# Altium schematic sheet Probe-Scope AFE v1.0.SchDoc: Probe-Scope: Analog Frontend
size Tabloid; CompanyName: Probe-Scope; Organization: Probe-Scope; Address1: Probe-Scope: Unified USB; Address2: Oscilloscope Probe; Address3: ©2019 M. Omo, J. Rowley,; SheetNumber: 3; PageSetup: Record=PageOptions|CenterHorizontal=True|CenterVertical=True|PrintScale=0.96|XCorrection=1.00|YCorrection=1.00|PrintKind=1|BorderSize=5000000|LeftOffset=0|BottomOffset=0|Orientation=2|PaperLength=1000|PaperWidth=1000|Scale=100|PaperSource=7|PrintQuality=-4|MediaType=1|DitherType=10|PaperKind=11x17|PrintScaleMode=1; Address4: K. Hall, released under the; License: CERN OHL v1.2
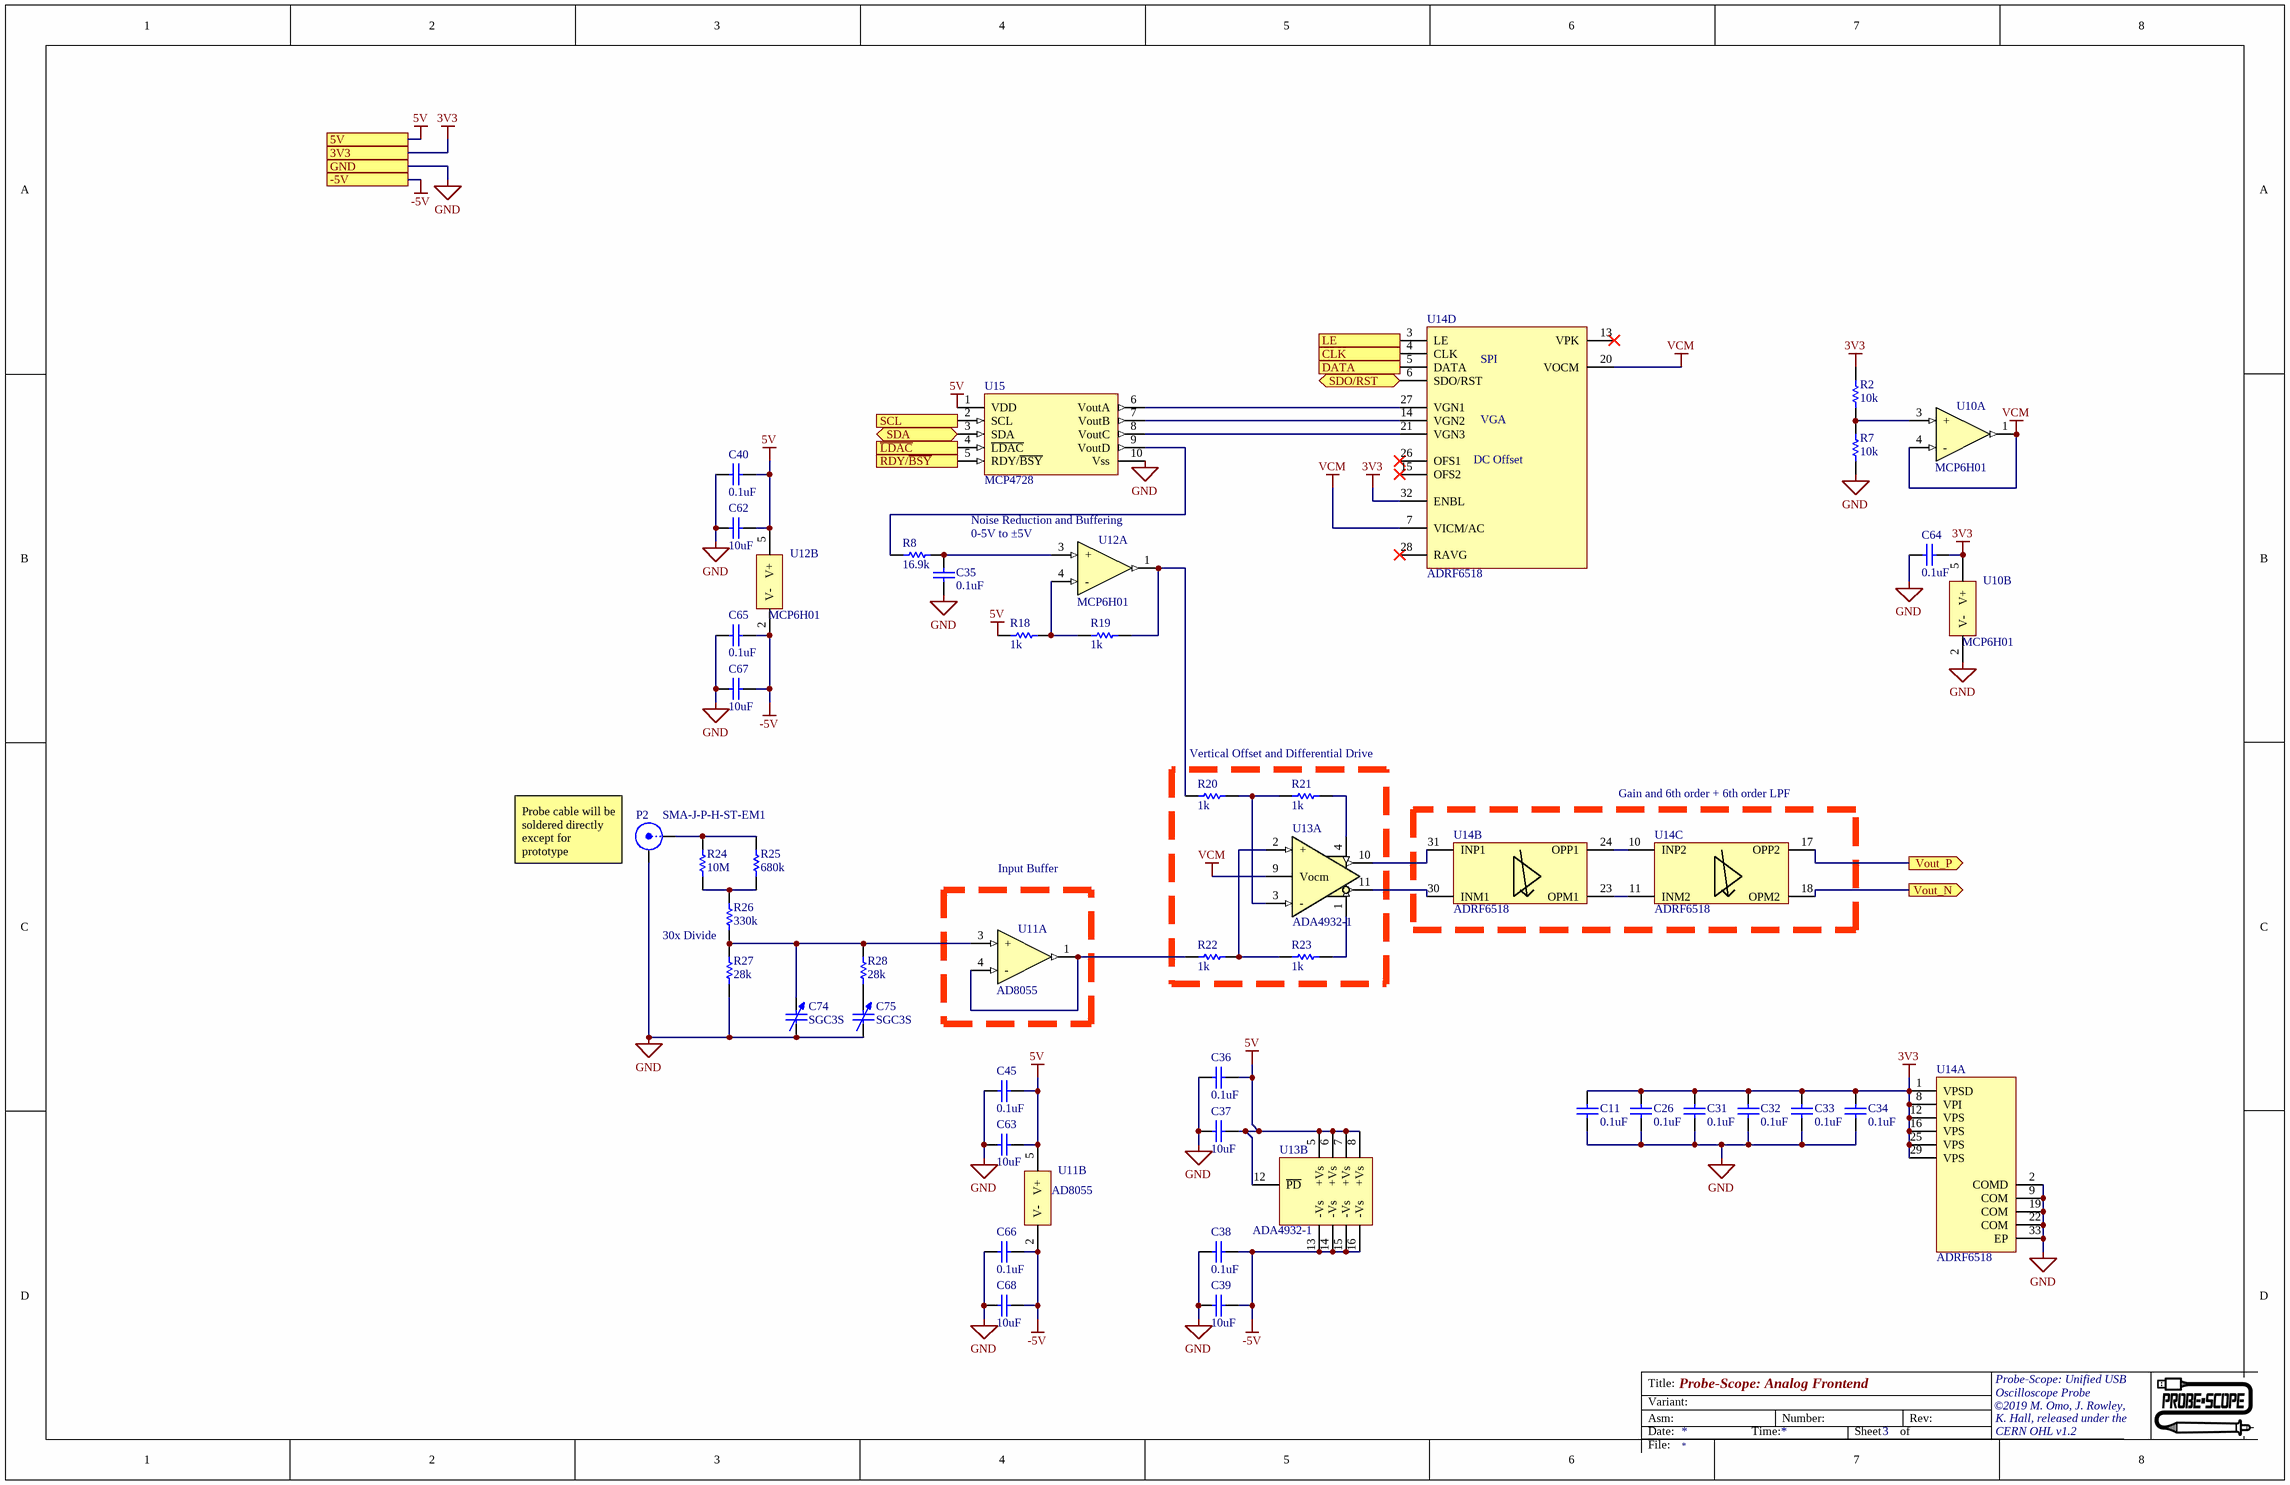
[diagram p0: Probe-Scope AFE v1.0.SchDoc]

## Parts
C11  value 0.1uF  [0402(1005)]  (hidden comment: 6.3V)
C26  value 0.1uF  [0402(1005)]  (hidden comment: 6.3V)
C31  value 0.1uF  [0402(1005)]  (hidden comment: 6.3V)
C32  value 0.1uF  [0402(1005)]  (hidden comment: 6.3V)
C33  value 0.1uF  [0402(1005)]  (hidden comment: 6.3V)
C34  value 0.1uF  [0402(1005)]  (hidden comment: 6.3V)
C35  value 0.1uF  [0402(1005)]  (hidden comment: 6.3V)
C36  value 0.1uF  [0402(1005)]  (hidden comment: 6.3V)
C37  value 10uF  [0603(1608)]  (hidden comment: 25V)
C38  value 0.1uF  [0402(1005)]  (hidden comment: 6.3V)
C39  value 10uF  [0603(1608)]  (hidden comment: 25V)
C40  value 0.1uF  [0402(1005)]  (hidden comment: 6.3V)
C45  value 0.1uF  [0402(1005)]  (hidden comment: 6.3V)
C62  value 10uF  [0603(1608)]  (hidden comment: 25V)
C63  value 10uF  [0603(1608)]  (hidden comment: 25V)
C64  value 0.1uF  [0402(1005)]  (hidden comment: 6.3V)
C65  value 0.1uF  [0402(1005)]  (hidden comment: 6.3V)
C66  value 0.1uF  [0402(1005)]  (hidden comment: 6.3V)
C67  value 10uF  [0603(1608)]  (hidden comment: 25V)
C68  value 10uF  [0603(1608)]  (hidden comment: 25V)
C74  SGC3S  [SGC3S]
C75  SGC3S  [SGC3S]
P2  SMA-J-P-H-ST-EM1  [*SMA-J-P-H-ST-EM1_SMA-J-P-H-ST-EM1(Primary)]
R2  value 10k  [0402(1005)]  (hidden comment: 0.1% 25ppm)
R7  value 10k  [0402(1005)]  (hidden comment: 0.1% 25ppm)
R8  value 16.9k  [0603(1608)]  (hidden comment: Res1)
R18  1k  [0402(1005)]
R19  1k  [0402(1005)]
R20  1k  [0402(1005)]
R21  1k  [0402(1005)]
R22  1k  [0402(1005)]
R23  1k  [0402(1005)]
R24  value 10M  [0402(1005)]  (hidden comment: Res1)
R25  value 680k  [0402(1005)]  (hidden comment: Res1)
R26  value 330k  [0402(1005)]  (hidden comment: Res1)
R27  value 28k  [0402(1005)]  (hidden comment: Res1)
R28  value 28k  [0402(1005)]  (hidden comment: Res1)
U10  MCP6H01  [SOT23-5]  (parts A,B of 2)
U11  AD8055  [SOT95P280X145-5L]  (parts A,B of 2)
U12  MCP6H01  [SOT23-5]  (parts A,B of 2)
U13  ADA4932-1  [QFN50P300X300X80_HS-17L]  (parts A,B of 2)
U14  ADRF6518  [QFN50P500X500X80_HS-33L]  (parts A,B,C,D of 4)
U15  MCP4728  [MSOP-10]

## Blocks framed on the sheet
Vertical Offset and Differential Drive: R20-R23 U13
Gain and 6th order + 6th order LPF: U14
Input Buffer: U11

## Ports
3V3, 5V, -5V, CLK (in), DATA (in), GND, LE (in), RDY/~{BSY} (out), SCL (in), SDA (bidir), SDO/RST (bidir), Vout_N (out), Vout_P (out), ~{LDAC} (in)

## Nets
3V3: C11.2 C26.2 C31.2 C32.2 C33.2 C34.2 C64.2 R2.2 U10.5(V+) U14.1(VPSD) U14.8(VPI) U14.12(VPS) U14.16(VPS) U14.25(VPS) U14.29(VPS) U14.32(ENBL) ; port 3V3
5V: C36.2 C37.2 C40.2 C45.2 C62.2 C63.2 R18.1 U11.5(V+) U12.5(V+) U13.5(+Vs) U13.6(+Vs) U13.7(+Vs) U13.8(+Vs) U13.12(~{PD}) U15.1(VDD) ; port 5V
-5V: C38.2 C39.2 C65.2 C66.2 C67.2 C68.2 U11.2(V-) U12.2(V-) U13.13(-Vs) U13.14(-Vs) U13.15(-Vs) U13.16(-Vs) ; port -5V
GND: C11.1 C26.1 C31.1 C32.1 C33.1 C34.1 C35.1 C36.1 C37.1 C38.1 C39.1 C40.1 C45.1 C62.1 C63.1 C64.1 C65.1 C66.1 C67.1 C68.1 C74.1 C75.1 P2.2(Y) R7.1 R27.1 U10.2(V-) U14.2(COMD) U14.9(COM) U14.19(COM) U14.22(COM) U14.33(EP) U15.10(Vss) ; port GND
VCM: U10.1(OUT) U10.4(-) U13.9(Vocm) U14.7(VICM/AC) U14.20(VOCM)
CLK: U14.4(CLK) ; port CLK
DATA: U14.5(DATA) ; port DATA
~{LDAC}: U15.4(~{LDAC}) ; port ~{LDAC}
LE: U14.3(LE) ; port LE
RDY/~{BSY}: U15.5(RDY/~{BSY}) ; port RDY/~{BSY}
SCL: U15.2(SCL) ; port SCL
SDA: U15.3(SDA) ; port SDA
SDO/RST: U14.6(SDO/RST) ; port SDO/RST
Vout_N: U14.18(OPM2) ; port Vout_N
Vout_P: U14.17(OPP2) ; port Vout_P
NetC35_2: C35.2 R8.2 U12.3(+)
NetC74_2: C74.2 R26.1 R27.2 R28.2 U11.3(+)
NetC75_2: C75.2 R28.1
NetP2_1: P2.1(X) R24.2 R25.2
NetR2_1: R2.1 R7.2 U10.3(+)
NetR8_1: R8.1 U15.9(VoutD)
NetR18_2: R18.2 R19.1 U12.4(-)
NetR19_2: R19.2 R20.1 U12.1(OUT)
NetR20_2: R20.2 R21.1 U13.3(-)
NetR21_2: R21.2 U13.4(+FB)
NetR22_1: R22.1 U11.1(OUT) U11.4(-)
NetR22_2: R22.2 R23.1 U13.2(+)
NetR23_2: R23.2 U13.1(-FB)
NetR24_1: R24.1 R25.1 R26.2
NetU13_10: U13.10(+out) U14.31(INP1)
NetU13_11: U13.11(-Out) U14.30(INM1)
NetU14_10: U14.10(INP2) U14.24(OPP1)
NetU14_11: U14.11(INM2) U14.23(OPM1)
NetU14_14: U14.14(VGN2) U15.7(VoutB)
NetU14_21: U14.21(VGN3) U15.8(VoutC)
NetU14_27: U14.27(VGN1) U15.6(VoutA)

Not connected (* = marked no-connect by the designer): U14 13(VPK)* 15(OFS2)* 26(OFS1)* 28(RAVG)*

## Notes on the sheet
- (near U12) Noise Reduction and Buffering
- 0-5V to ±5V
- (near P2) Probe cable will be soldered directly except for prototype
- (near R26) 30x Divide
- Title:
- Asm:
- Date:
- Variant:
- Time:
- Number:
- Sheet
- of
- Rev:
- File:
- (in symbol ADRF6518, part D) SPI; VGA; DC Offset

## Library data of the parts
C11 C26 C31-C36 C38 C40 C45 C64-C66 = 1875: Key: 1875; MENG_PN: ???1875; MANF: Samsung Electro-Mechanics; MANF_PN: CL05B104KQ5NNNC; VENDOR: Digikey; VENDOR_PN: 1276-1511-1-ND; P&V Description: Capacitor, Ceramic, 0.1uF, 6.3V, 10% Tol, 125C, X7R, 0402, SMD; Class: Capacitor; Type: Ceramic; Other: X7R; Tolerance: 10; Voltage: 6.3; Max Temperature: 125; Approved: False; Package: 0402; SMD: True; Date Modified: 11/6/2018 11:14:02 AM; Modified By: jrowley; Parent Key: 1875; Verified: False
C37 C39 C62 C63 C67 C68 = 1306: Key: 1306; MENG_PN: ???1306; MANF: Samsung Electro-Mechanics; MANF_PN: CL10A106MA8NRNC; VENDOR: Digikey; VENDOR_PN: 1276-1869-1-ND; P&V Description: Capacitor, Ceramic, 10uF, 25V, 20% Tol, 85C, X5R, 0603, SMD; Class: Capacitor; Type: Ceramic; Other: X5R; Tolerance: 20; Voltage: 25; Max Temperature: 85; Approved: True; Package: 0603; SMD: True; Date Modified: 3/3/2015 11:08:29 AM; Modified By: sotterbacher; Parent Key: 1306; Verified: True
C74 C75 = VarCap
P2 = SMA-J-P-H-ST-EM1: MANF: Samtec Inc.; VENDOR: Digikey; VENDOR_PN: SAM8857-ND; MANF_PN: SMA-J-P-H-ST-EM1
R2 R7 = 1806: KEY: 1806; MENG_PN: ???1806; MANF: Stackpole Electronics; MANF_PN: RMCF0402FT10K0; VENDOR: Digikey; VENDOR_PN: RMCF0402FT10K0CT-ND; P&V Description: Resistor, Thick Film, 10k Ohms, 0.0625W, 1% Tol, 100V, 0402, SMD; Class: Resistor; Tolerance: 1; Power: 0.0625; Voltage: 100; Approved: False; Type: Thick Film; Package: 0402; SMD: True; Date Modified: 8/27/2018 6:34:02 PM; Modified By: jrowley; Expr1026: 1806; Parent Key: 1806; Verified: False
R8 = 1011: Key: 1011; MENG_PN: ???1011; MANF: Panasonic; MANF_PN: ERJ-3EKF1692V; VENDOR: Digikey; VENDOR_PN: P16.9KHCT-ND; P&V Description: Resistor, Thick Film, 16.9k Ohms, 0.1W, 1% Tol, 0603, SMD; Class: Resistor; Tolerance: 1; Power: 0.1; Approved: True; Type: Thick Film; Package: 0603; SMD: True; Date Modified: 8/12/2013 4:27:29 PM; Modified By: sotterbacher; Expr1026: 1011; Parent Key: 1011; Verified: True
R18-R23 = 1982: KEY: 1982; MENG_PN: ???1982; MANF: Yageo; MANF_PN: RC0402FR-071KL; VENDOR: Digikey; VENDOR_PN: 311-1.00KLRCT-ND; P&V Description: Resistor, Thick Film, 1k Ohms, 0.063W, 1% Tol, 1kOhm, 1%, 1/16W, Thick Film, 0402, SMD; Class: Resistor; Other: 1kOhm, 1%, 1/16W, Thick Film; Tolerance: 1; Power: 0.063; Approved: False; Value: 1k; Type: Thick Film; Package: 0402; SMD: True; Date Modified: 3/25/2019 11:32:32 AM; Modified By: jrowley; Expr1026: 1982; Parent Key: 1982; Verified: False
R24 = 2070: Key: 2070; MENG_PN: ???2070; MANF: Vishay Dale; MANF_PN: CRCW040210M0FKEDC; VENDOR: Digikey; VENDOR_PN: 541-4068-1-ND; P&V Description: Resistor, Thick Film, 10M Ohms, 0.063W, 1% Tol, 0402, SMD; Class: Resistor; Tolerance: 1; Power: 0.063; Approved: False; Type: Thick Film; Package: 0402; SMD: True; Date Modified: 6/20/2019 8:44:42 PM; Modified By: momo; Expr1026: 2070; Parent Key: 2070; Verified: False
R25 = 2069: Key: 2069; MENG_PN: ???2069; MANF: Vishay Dale; MANF_PN: CRCW0402680KJNED; VENDOR: Digikey; VENDOR_PN: 541-680KJCT-ND; P&V Description: Resistor, Thick Film, 680k Ohms, 0.063W, 1% Tol, 0402, SMD; Class: Resistor; Tolerance: 1; Power: 0.063; Approved: False; Type: Thick Film; Package: 0402; SMD: True; Date Modified: 6/20/2019 8:41:19 PM; Modified By: momo; Expr1026: 2069; Parent Key: 2069; Verified: False
R26 = 2068: Key: 2068; MENG_PN: ???2068; MANF: Vishay Dale; MANF_PN: CRCW0402330KFKEDHP; VENDOR: Digikey; VENDOR_PN: 541-330KYCT-ND; P&V Description: Resistor, Thick Film, 330k Ohms, 0.2W, 1% Tol, 0402, SMD; Class: Resistor; Tolerance: 1; Power: 0.2; Approved: False; Type: Thick Film; Package: 0402; SMD: True; Date Modified: 6/20/2019 8:37:56 PM; Modified By: momo; Expr1026: 2068; Parent Key: 2068; Verified: False
R27 R28 = 2071: Key: 2071; MENG_PN: ???2071; MANF: Vishay Dale; MANF_PN: CRCW040228K0FKED; VENDOR: Digikey; VENDOR_PN: 541-28.0KLCT-ND; P&V Description: Resistor, Thick Film, 28k Ohms, 0.063W, 1% Tol, 0402, SMD; Class: Resistor; Tolerance: 1; Power: 0.063; Approved: False; Type: Thick Film; Package: 0402; SMD: True; Date Modified: 6/20/2019 8:52:22 PM; Modified By: momo; Expr1026: 2071; Parent Key: 2071; Verified: False
U10 U12 = 2108: Key: 2108; MENG_PN: ???2108; MANF: Microchip; MANF_PN: MCP6H01T-E/OT; VENDOR: Digikey; VENDOR_PN: MCP6H01T-E/OTCT-ND; P&V Description: IC, Op Amp, 3.5V to 16V, SOT-23-5, SMD; Class: IC; Other: 3.5V to 16V; Approved: False; Type: Op Amp; Package: SOT-23-5; SMD: True; Date Modified: 7/10/2019 7:11:20 PM; Modified By: momo; Parent Key: 2108; Verified: False
U11 = AD8055: MANF: Analog Devices Inc.; MANF_PN: AD8055ARTZ-REEL7; VENDOR: DigiKey; VENDOR_PN: AD8055ARTZ-REEL7CT-ND
U13 = ADA4932: MANF: Analog Devices Inc.; MANF_PN: ADA4932-1YCPZ-R7; VENDOR: DigiKey; VENDOR_PN: ADA4932-1YCPZ-R7CT-ND
U14 = ADRF6518: MANF: Analog Devices Inc.; MANF_PN: ADRF6518ACPZ-R7; VENDOR: DigiKey; VENDOR_PN: ADRF6518ACPZ-R7TR-ND
U15 = MCP4728: MANF: Microchip Technology; MANF_PN: MCP4728T-E/UN; VENDOR: DigiKey; VENDOR_PN: MCP4728T-E/UNCT-ND